# Altium project MC_AI.PrjPcb
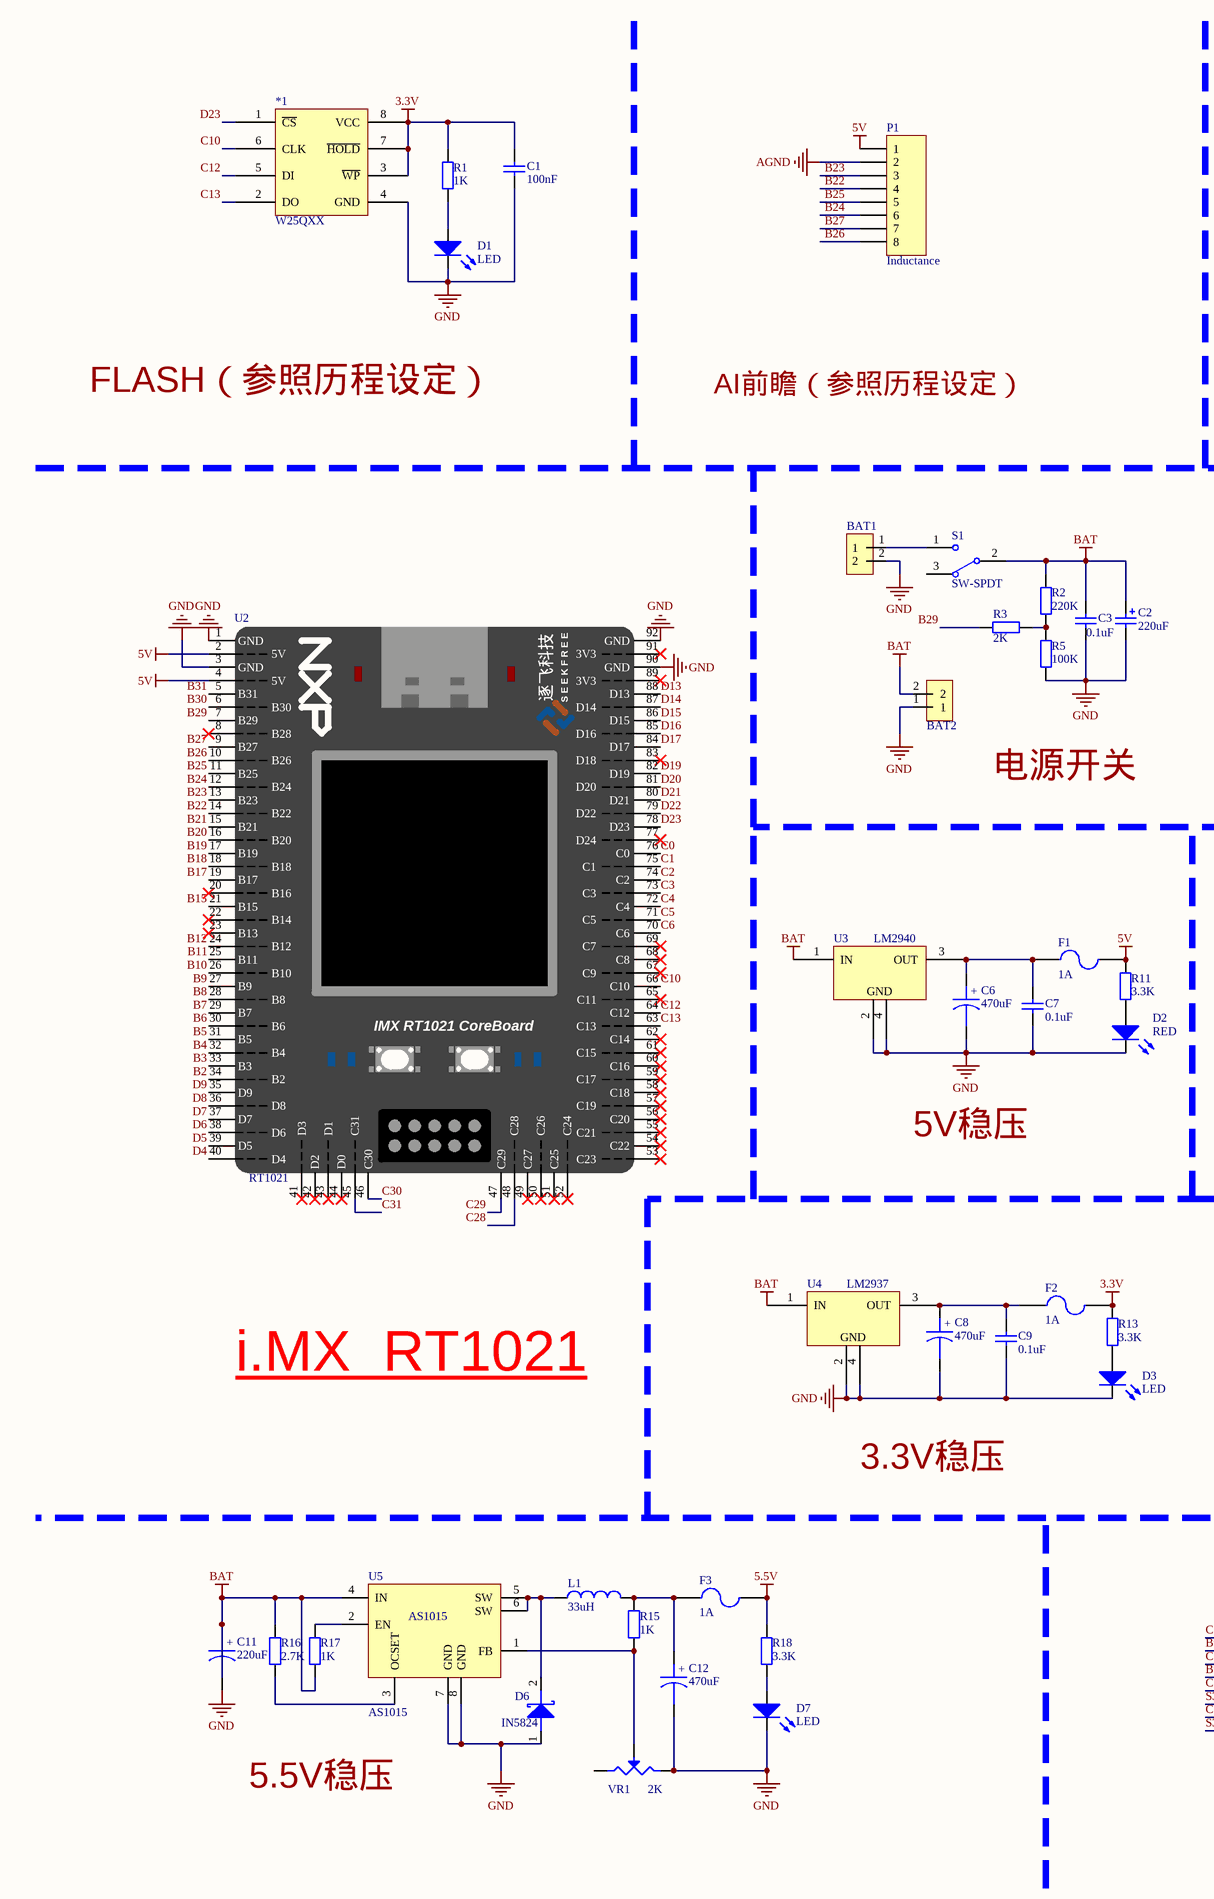
[diagram p0: AI原理图.SchDoc, left]
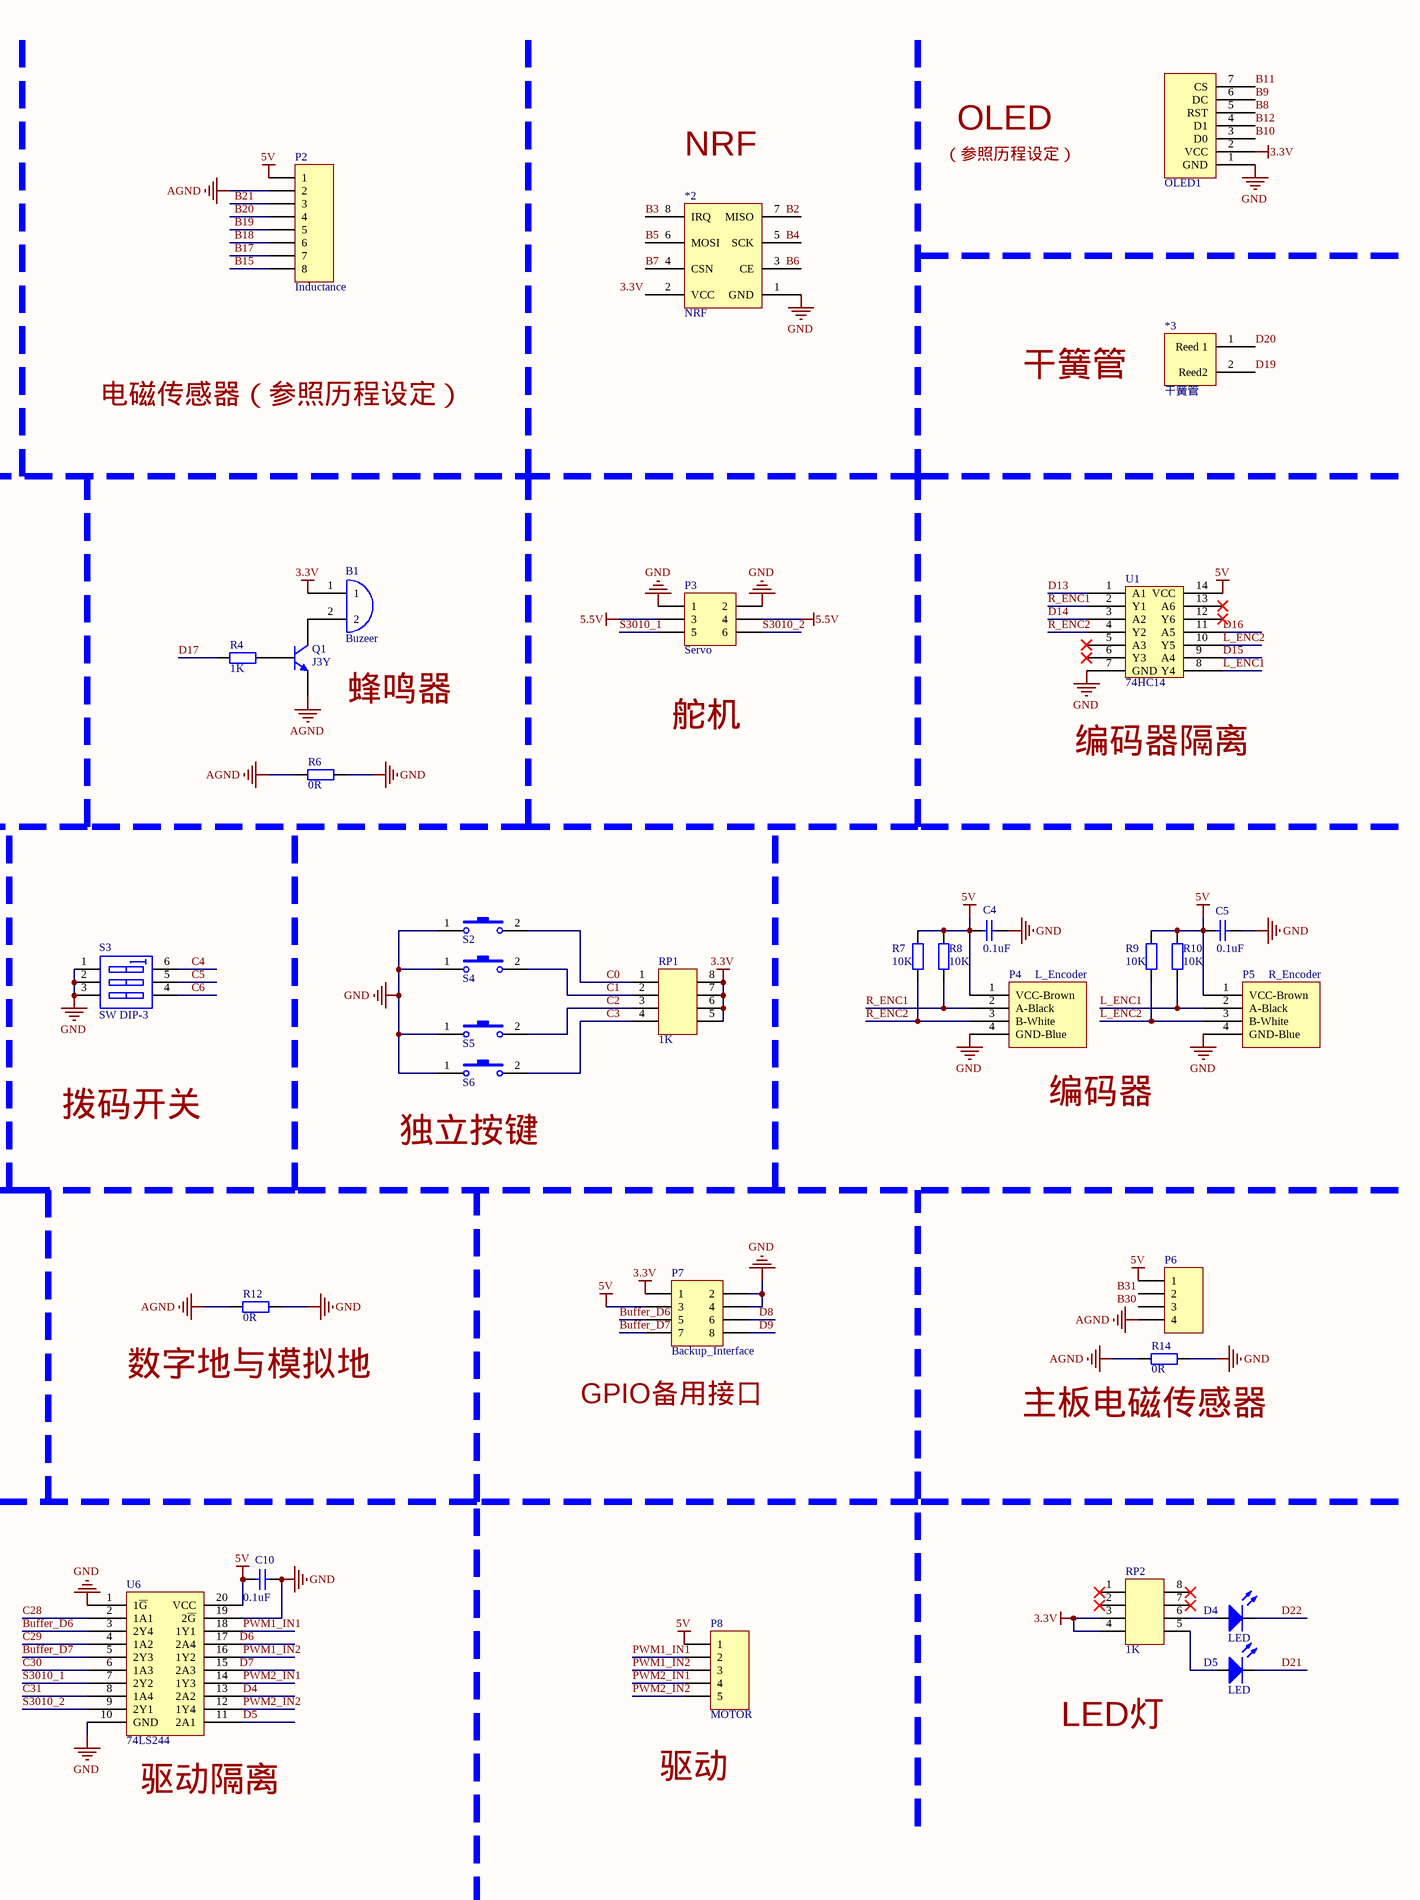
[diagram p1: AI原理图.SchDoc, right]
1 sheet, 72 parts. Net scope: global (net labels, ports and power ports of the same name join across sheets).
Board file: AI_PCB.PcbDoc

## Sheet AI原理图.SchDoc
size C

### Parts
*1  W25QXX  [SOP8_M]
*2  NRF  [HDR2X4]
*3  干簧管  [HDR1X2]
B1  Buzeer  [BUZEER]
BAT1  电池  [PIN2]  (value not drawn)
BAT2  驱动  [T]  (value not drawn)
C1  100nF  [0805C]
C2  220uF  [直插电解电容]
C3  0.1uF  [0805C]
C4  0.1uF  [0805C]
C5  0.1uF  [0805C]
C6  470uF  [LQ_C10X10]
C7  0.1uF  [0805C]
C8  470uF  [LQ_C10X10]
C9  0.1uF  [0805C]
C10  0.1uF  [0805C]
C11  220uF  [直插电解电容]
C12  470uF  [LQ_C10X10]
D1  LED  [LED0805R]
D2  RED  [LED0805R]
D3  LED  [LED0805R]
D4  LED  [LED0805R]
D5  LED  [LED0805R]
D6  IN5824  [SMA]
D7  LED  [LED0805R]
F1  1A  [C1206]
F2  1A  [C1206]
F3  1A  [C1206]
L1  33uH  [L7*7]
OLED1  OLED128X64  [OLED128x64]  (value not drawn)
P1  Inductance  [HDR1X8]
P2  Inductance  [HDR1X8]
P3  Servo  [HDR2X3]
P4  L_Encoder  [4针凹槽]
P5  R_Encoder  [4针凹槽]
P6  Header 4  [HDR1X4]  (value not drawn)
P7  Backup_Interface  [HDR2X4]
P8  MOTOR  [HDR1X5]
Q1  J3Y  [SOT23-3N]
R1  1K  [0805-1R]
R2  220K  [0805-1R]
R3  2K  [0805-1R]
R4  1K  [0805-1R]
R5  100K  [0805-1R]
R6  0R  [0805-1R]
R7  10K  [0805-1R]
R8  10K  [0805-1R]
R9  10K  [0805-1R]
R10  10K  [0805-1R]
R11  3.3K  [0805-1R]
R12  0R  [0805-1R]
R13  3.3K  [0805-1R]
R14  0R  [0805-1R]
R15  1K  [0805-1R]
R16  2.7K  [0805-1R]
R17  1K  [0805-1R]
R18  3.3K  [0805-1R]
RP1  1K  [0603_4A]
RP2  1K  [0603_4A]
S1  SW-SPDT  [SW-TO3]
S2  SW-PB  [BT4SMT]  (value not drawn)
S3  SW DIP-3  [SW-DIP6]
S4  SW-PB  [BT4SMT]  (value not drawn)
S5  SW-PB  [BT4SMT]  (value not drawn)
S6  SW-PB  [BT4SMT]  (value not drawn)
U1  74HC14  [SOP14]
U2  RT1021  [GAI]
U3  LM2940  [TO263-3A]
U4  LM2937  [TO263-3A]
U5  AS1015  [SOP-8L]
U6  74LS244  [SOP20]
VR1  2K  [3296W]

### Nets
3.3V: *1.3(~{WP}) *1.7(~{HOLD}) *1.8(VCC) *2.2(VCC) B1.1 C1.1 F2.2 OLED1.2(VCC) P7.1 R1.2 R13.2 RP1.5 RP1.6 RP1.7 RP1.8 RP2.3 RP2.4
5.5V: F3.2 P3.3 P3.4 R18.2
5V: C4.1 C5.1 C10.1 F1.2 P1.1 P2.1 P4.1(VCC-Brown) P5.1(VCC-Brown) P6.1 P7.3 P8.1 R7.2 R8.2 R9.2 R10.2 R11.2 U1.14(VCC) U2.2(5V) U2.4(5V) U6.20(VCC)
AGND: P1.2 P2.2 P6.4 Q1.3(E) R6.1 R12.1 R14.1
BAT: BAT2.2 C2.1 C3.2 C11.1 R2.2 R16.2 R17.1 S1.2 U3.1(IN) U4.1(IN) U5.4(IN)
GND: *1.4(GND) *2.1(GND) BAT1.2 BAT2.1 C1.2 C2.2 C3.1 C4.2 C5.2 C6.2 C7.1 C8.2 C9.1 C10.2 C11.2 C12.2 D1.2(K) D2.2(K) D3.2(K) D6.1 D7.2(K) OLED1.1(GND) P3.1 P3.2 P4.4(GND-Blue) P5.4(GND-Blue) P7.2 P7.4 R5.1 R6.2 R12.2 R14.2 S2.1 S3.1(A1) S3.2(A2) S3.3(A3) S4.1 S5.1 S6.1 U1.7(GND) U2.1(GND) U2.3(GND) U2.90(GND) U2.92(GND) U3.2(GND) U3.4(GND) U4.2(GND) U4.4(GND) U5.7(GND) U5.8(GND) U6.1(1~{G}) U6.10(GND) U6.19(2~{G}) VR1.2
B2: *2.7(MISO) U2.34(B2)
B3: *2.8(IRQ) U2.33(B3)
B4: *2.5(SCK) U2.32(B4)
B5: *2.6(MOSI) U2.31(B5)
B6: *2.3(CE) U2.30(B6)
B7: *2.4(CSN) U2.29(B7)
B8: OLED1.5(RST) U2.28(B8)
B9: OLED1.6(DC) U2.27(B9)
B10: OLED1.3(D0) U2.26(B10)
B11: OLED1.7(CS) U2.25(B11)
B12: OLED1.4(D1) U2.24(B12)
B15: P2.8 U2.21(B15)
B17: P2.7 U2.19(B17)
B18: P2.6 U2.18(B18)
B19: P2.5 U2.17(B19)
B20: P2.4 U2.16(B20)
B21: P2.3 U2.15(B21)
B22: P1.4 U2.14(B22)
B23: P1.3 U2.13(B23)
B24: P1.6 U2.12(B24)
B25: P1.5 U2.11(B25)
B26: P1.8 U2.10(B26)
B27: P1.7 U2.9(B27)
B29: R3.2 U2.7(B29)
B30: P6.3 U2.6(B30)
B31: P6.2 U2.5(B31)
Buffer_D6: P7.5 U6.3(2Y4)
Buffer_D7: P7.7 U6.5(2Y3)
C0: RP1.1 S2.2 U2.76(C0)
C1: RP1.2 S4.2 U2.75(C1)
C2: RP1.3 S5.2 U2.74(C2)
C3: RP1.4 S6.2 U2.73(C3)
C4: S3.6(B1) U2.72(C4)
C5: S3.5(B2) U2.71(C5)
C6: S3.4(B3) U2.70(C6)
C10: *1.6(CLK) U2.66(C10)
C12: *1.5(DI) U2.64(C12)
C13: *1.2(DO) U2.63(C13)
C28: U2.48(C28) U6.2(1A1)
C29: U2.47(C29) U6.4(1A2)
C30: U2.46(C30) U6.6(1A3)
C31: U2.45(C31) U6.8(1A4)
D4: U2.40(D4) U6.13(2A2)
D5: U2.39(D5) U6.11(2A1)
D6: U2.38(D6) U6.17(2A4)
D7: U2.37(D7) U6.15(2A3)
D8: P7.6 U2.36(D8)
D9: P7.8 U2.35(D9)
D13: U1.1(A1) U2.88(D13)
D14: U1.3(A2) U2.87(D14)
D15: U1.9(A4) U2.86(D15)
D16: U1.11(A5) U2.85(D16)
D17: R4.1 U2.84(D17)
D19: *3.2(Reed2) U2.82(D19)
D20: *3.1(Reed_1) U2.81(D20)
D21: D5.2(K) U2.80(D21)
D22: D4.2(K) U2.79(D22)
D23: *1.1(~{CS}) U2.78(D23)
L_ENC1: P5.2(A-Black) R10.1 U1.8(Y4)
L_ENC2: P5.3(B-White) R9.1 U1.10(Y5)
PWM1_IN1: P8.2 U6.18(1Y1)
PWM1_IN2: P8.3 U6.16(1Y2)
PWM2_IN1: P8.4 U6.14(1Y3)
PWM2_IN2: P8.5 U6.12(1Y4)
R_ENC1: P4.2(A-Black) R8.1 U1.2(Y1)
R_ENC2: P4.3(B-White) R7.1 U1.4(Y2)
S3010_1: P3.5 U6.7(2Y2)
S3010_2: P3.6 U6.9(2Y1)
NetB1_2: B1.2 Q1.1(C)
NetBAT1_1: BAT1.1 S1.1
NetC6_1: C6.1 C7.2 F1.1 U3.3(OUT)
NetC8_1: C8.1 C9.2 F2.1 U4.3(OUT)
NetC12_1: C12.1 F3.1 L1.2 R15.2
NetD1_1: D1.1(A) R1.1
NetD2_1: D2.1(A) R11.1
NetD3_1: D3.1(A) R13.1
NetD4_1: D4.1(A) RP2.6
NetD5_1: D5.1(A) RP2.5
NetD6_2: D6.2 L1.1 U5.5(SW) U5.6(SW)
NetD7_1: D7.1(A) R18.1
NetQ1_2: Q1.2(B) R4.2
NetR2_1: R2.1 R3.1 R5.2
NetR15_1: R15.1 U5.1(FB) VR1.3(W)
NetR16_1: R16.1 U5.3(OCSET)
NetR17_2: R17.2 U5.2(EN)

Not connected (* = marked no-connect by the designer): RP2 1* 2* 7* 8*; S1 3; U1 5(A3)* 6(Y3)* 12(Y6)* 13(A6)*; U2 8(B28)* 20(B16)* 22(B14)* 23(B13)* 41(D3)* 42(D2)* 43(D1)* 44(D0)* 49(C27)* 50(C26)* 51(C25)* 52(C24)* 53(C23)* 54(C22)* 55(C21)* 56(C20)* 57(C19)* 58(C18)* 59(C17)* 60(C16)* 61(C15)* 62(C14)* 65(C11)* 67(C9)* 68(C8)* 69(C7)* 77(D24)* 83(D18)* 89(3V3)* 91(3V3)*; VR1 1

### Notes on the sheet
- OLED
- NRF
- （参照历程设定）
- FLASH（参照历程设定）
- AI前瞻（参照历程设定）
- 电磁传感器（参照历程设定）
- 干簧管
- 蜂鸣器
- 舵机
- 电源开关
- 编码器隔离
- 拨码开关
- 编码器
- 5V稳压
- (near S6) 独立按键
- i.MX  RT1021 <http://i.MX  RT1021>
- (near R12) 数字地与模拟地
- (near P7) GPIO备用接口
- (near R14) 主板电磁传感器
- 3.3V稳压
- 5.5V稳压
- LED灯
- (near U6) 驱动隔离
- 驱动
- Title
- Size:
- Date:
- File:
- C
- Number:
- Time:
- Revision:
- Sheet
- of
- (in symbol CAPACITOR POL) +
- (in symbol MIMXRT1021xAGxA_CoreBoard) 逐飞科技; S E E K F R E E; IMX RT1021 CoreBoard

### Library data of the parts
B1 = Buzzer
BAT1 BAT2 = Header 2: Jumper
C1 C3-C5 C7 C9 C10 = Cap Semi: Capacitor (Semiconductor SIM Model); Published: 8-Jun-2000; LatestRevisionDate: 29-May-2009; LatestRevisionNote: IPC-7351 Footprint Added.; PackageReference: C1206; Publisher: Altium Limited; PackageDescription: Chip Capacitor
C2 = Cap Pol1: Polarized Capacitor (Radial); Published: 8-Jun-2000; LatestRevisionDate: 17-Jul-2002; LatestRevisionNote: Re-released for DXP Platform.; PackageReference: RB7.6-15; Publisher: Altium Limited; PackageDescription: Polarized Capacitor (Radial); 2 Leads
C6 C8 C11 C12 = CAPACITOR POL: Capacitor
D1-D5 D7 = LED2: Typical RED, GREEN, YELLOW, AMBER GaAs LED; Published: 8-Jun-2000; LatestRevisionDate: 17-Jul-2002; LatestRevisionNote: Re-released for DXP Platform.; PackageVersion: Feb-2002; PackageReference: 3.2X1.6X1.1; Publisher: Altium Limited; PackageDescription: SM LED; 2 Flat Leads
D6 = D-MBRA140T3: MBRA140T3; pin to pad: A>1 K>2
F1-F3 = Fuse 2: Fuse; Published: 8-Jun-2000; LatestRevisionDate: 17-Jul-2002; LatestRevisionNote: Re-released for DXP Platform.; PackageReference: PIN-W2/E2.8; Publisher: Altium Limited; PackageDescription: Thru-Hole; 2 Leads
L1 = Inductor
P1 P2 = Header 8: Header, 8-Pin; LatestRevisionDate: 17-Jul-2002; LatestRevisionNote: Re-released for DXP Platform.; Publisher: Altium Limited
P3 = Header 3X2: Header, 3-Pin, Dual row; LatestRevisionDate: 17-Jul-2002; LatestRevisionNote: Re-released for DXP Platform.; Publisher: Altium Limited
P4 P5 = COODER
P6 = Header 4: Header, 4-Pin; LatestRevisionDate: 17-Jul-2002; LatestRevisionNote: Re-released for DXP Platform.; Publisher: Altium Limited
P7 = Header 4X2: Header, 4-Pin, Dual row; LatestRevisionDate: 17-Jul-2002; LatestRevisionNote: Re-released for DXP Platform.; Publisher: Altium Limited
P8 = Header 5: Header, 5-Pin; LatestRevisionDate: 17-Jul-2002; LatestRevisionNote: Re-released for DXP Platform.; Publisher: Altium Limited
Q1 = NPN: NPN Bipolar Transistor; Published: 8-Jun-2000; LatestRevisionDate: 17-Jul-2002; LatestRevisionNote: Re-released for DXP Platform.; PackageReference: TO-226-AA; Publisher: Altium Limited; PackageDescription: TO, Flat Index; 3 In-Line, Axial Leads; Body Dia. 4.8mm; Leads 0.55 x 0.51 mm (max); Code_JEDEC: TO-226-AA
R1-R18 = Res2: Resistor; Published: 8-Jun-2000; LatestRevisionDate: 17-Jul-2002; LatestRevisionNote: Re-released for DXP Platform.; PackageReference: AXIAL-0.4; Publisher: Altium Limited
  R7-R10: PackageDescription: Axial Device, Thru-Hole; 2 Leads; 0.4 in Pin Spacing
RP1 RP2 = B型贴片阻排—8
S1 = SW-SPDT: SPDT Subminiature Toggle Switch, Right Angle Mounting, Vertical Actuation; Published: 24-Mar-1999; LatestRevisionDate: 17-Dec-2003; LatestRevisionNote: Schematic revised, PCB Footprint replaced.; DatasheetVersion: 05-Dec-2000; PackageReference: TL36WW15050; Publisher: Altium Limited; PackageDescription: Switch; 4 Leads; ComponentLink1Description: Manufacturer Link; ComponentLink1URL: http://www.apem.com
S2 S4-S6 = SW-PB: Switch; Published: 24-Mar-1999; LatestRevisionDate: 17-Jul-2002; LatestRevisionNote: Re-released for DXP Platform.; PackageReference: SPST-2; Publisher: Altium Limited; PackageDescription: Switch; 2 Leads
S3 = SW DIP-3: DIP Switch, 3 Position, SPST; Published: 24-Mar-1999; LatestRevisionDate: 17-Jul-2002; LatestRevisionNote: Re-released for DXP Platform.; PackageReference: DIP-6; Publisher: Altium Limited; Code_JEDEC: MO-001-AM
U2 = MIMXRT1021xAGxA_CoreBoard: 逐飞科技i.MX RT1021核心板整体原理，可直接使用
U3 U4 = LM2940CT-5.0
VR1 = R-GLIDE